# Altium project BGT24LTR11 RF-Shield Board V3.0.PrjPCB (part 2 of 2)

## Sheet 06 Arduino UNO.SchDoc: <Project Name>
size A3; ApprovedBy: <Appr.>; Author: <Author>; CompanyName: Infineon Technologies AG; Engineer: <Rel.>; Organization: Infineon Technologies AG; Address1: IFAG DES S PS; Address2: Am Campeon 1-12  -  85579 Neubiberg  -  Germany; Address3: 85579 Neubiberg; Address4: Germany; Revision: <Rev.>; SheetNumber: 6; Release: RC00; PageSetup: Record=PageOptions|CenterHorizontal=True|CenterVertical=True|PrintScale=1.01|XCorrection=1.00|YCorrection=1.00|PrintKind=0|BorderSize=5000000|LeftOffset=0|BottomOffset=0|Orientation=2|PaperLength=1000|PaperWidth=1000|Scale=100|PaperSource=7|PrintQuality=-4|MediaType=1|DitherType=10|PaperKind=A3|PrintScaleMode=1; Doc_ConfidentialStatus: <Doc_ConfidentialStatus>; Doc_Preliminary: <Doc_Preliminary>
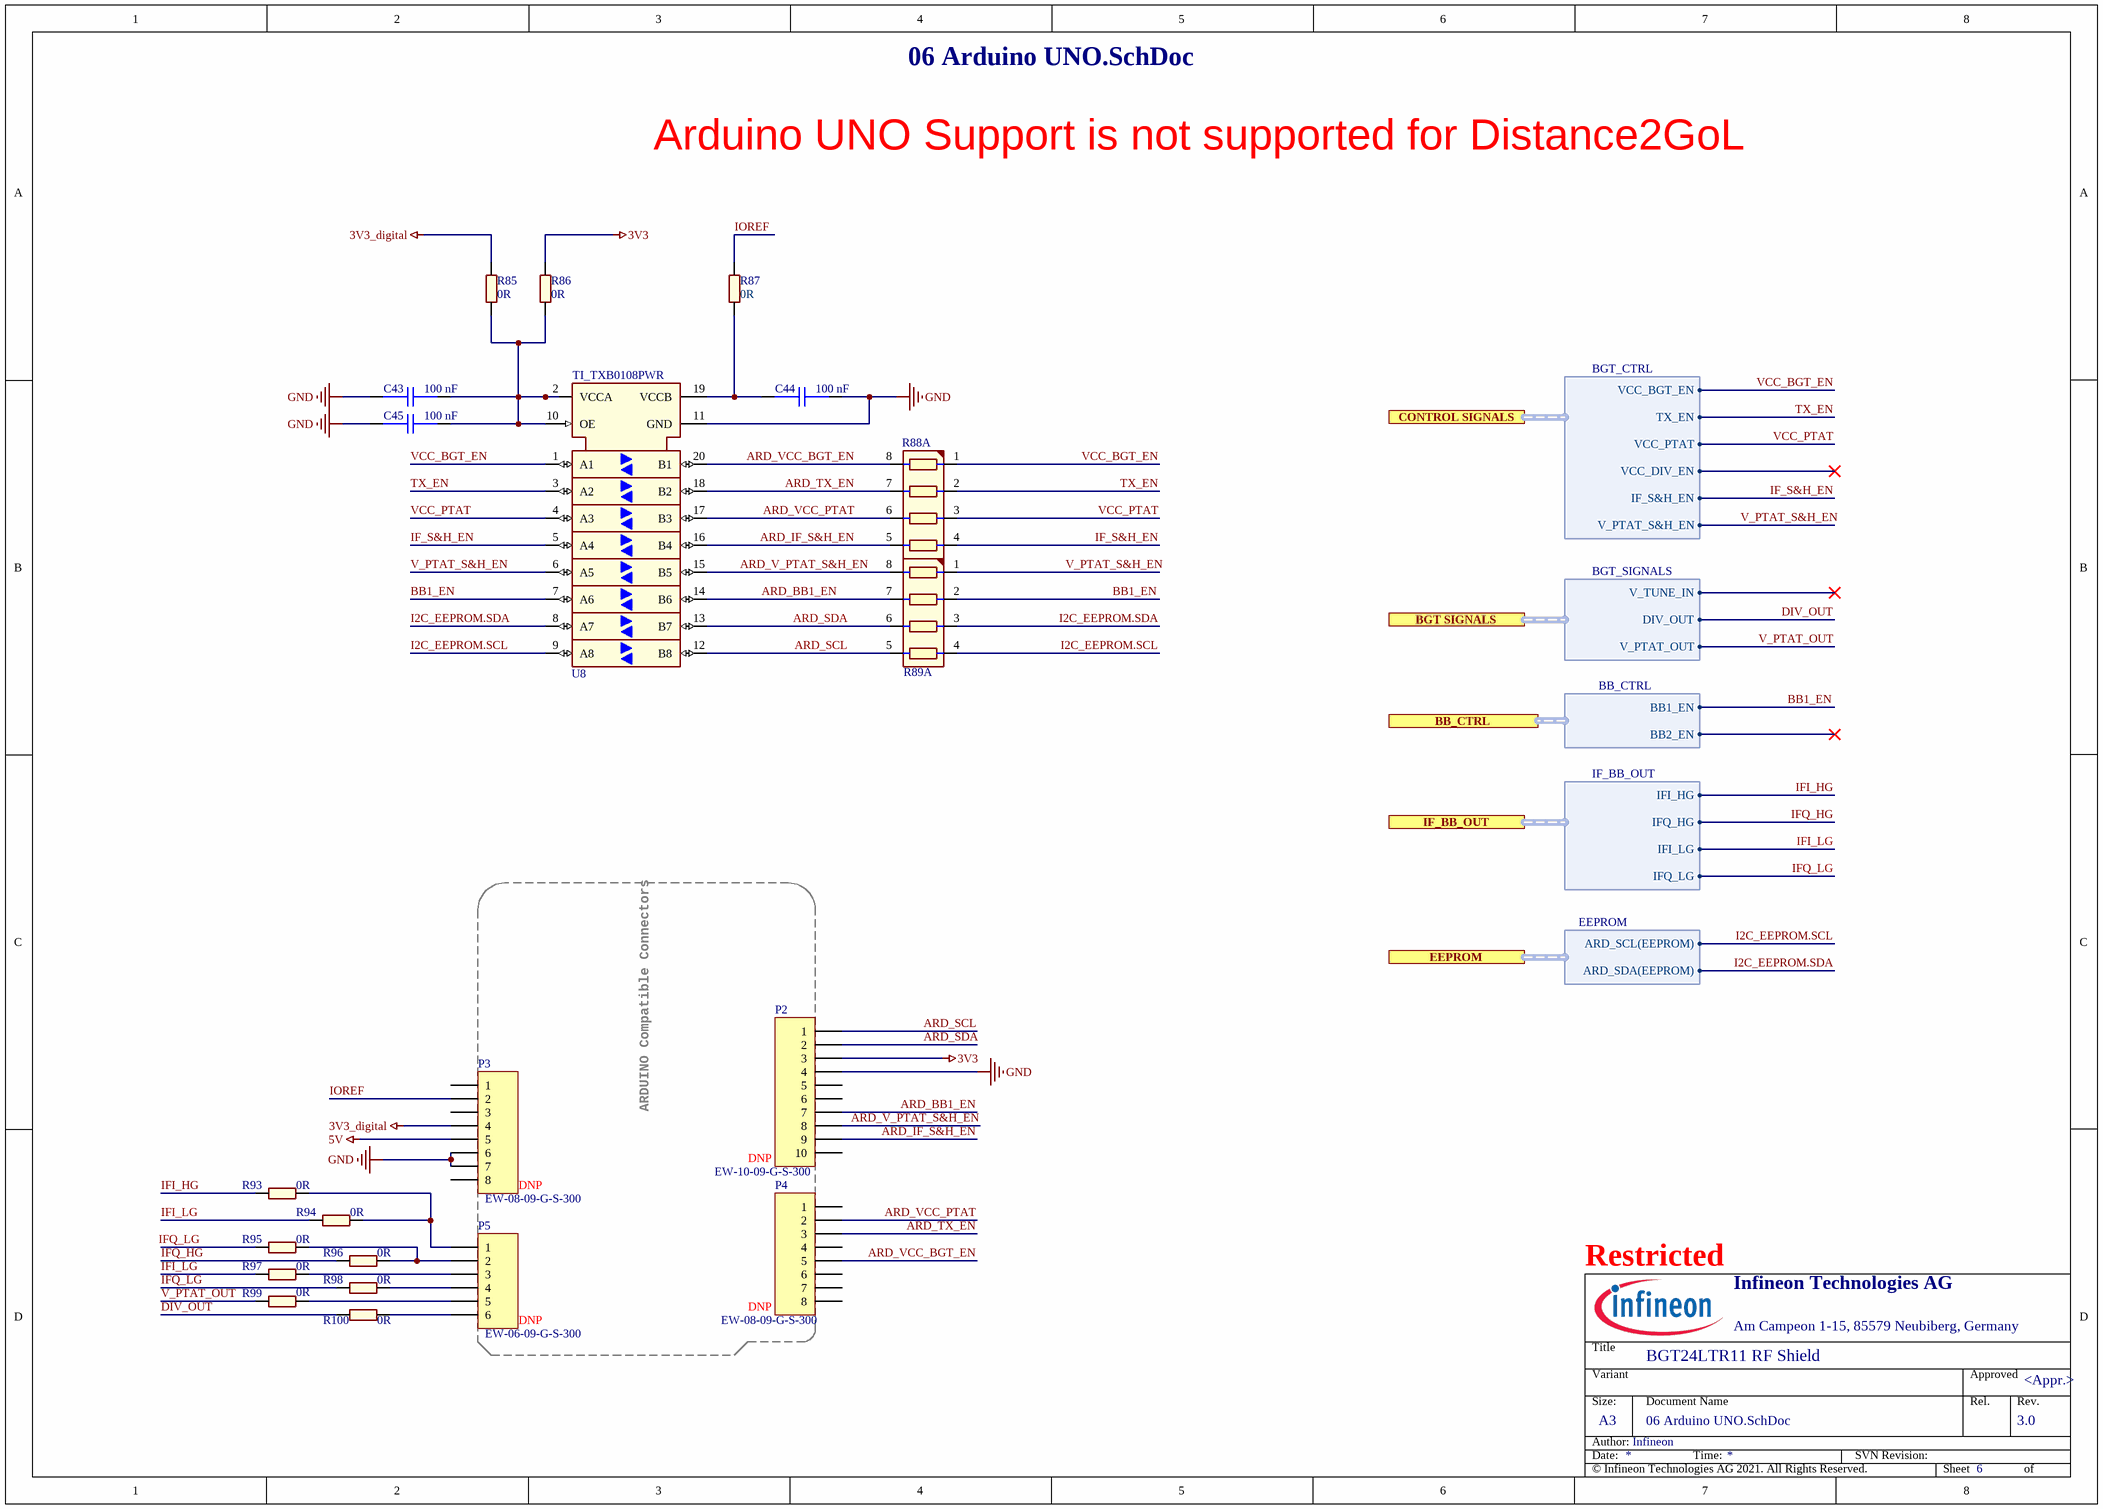
[diagram p4: 06 Arduino UNO.SchDoc]

### Parts
C43  100 nF  [CAPC1005X55N-0_2]
C44  100 nF  [CAPC1005X55N-0_2]
C45  100 nF  [CAPC1005X55N-0_2]
P2  DNP  Manufacturer Part Number: EW-10-09-G-S-300  [HDR1X10_Plug - DNP]
P3  DNP  Manufacturer Part Number: EW-08-09-G-S-300  [HDR1X8_Plug - DNP]
P4  DNP  Manufacturer Part Number: EW-08-09-G-S-300  [HDR1X8_Plug - DNP]
P5  DNP  Manufacturer Part Number: EW-06-09-G-S-300  [HDR1X6_Plug - DNP]
R85  0R  [RESC1005X40N_2]
R86  0R  [RESC1005X40N_2]
R87  0R  [RESC1005X40N_2]
R88  DNP  [RESCAX50P100X200X45-8N - DNP]  (value not drawn)  (part A of 4)
R89  DNP  [RESCAX50P100X200X45-8N - DNP]  (value not drawn)  (part A of 4)
R93  0R  [RESC1005X40N_2]
R94  0R  [RESC1005X40N_2]
R95  0R  [RESC1005X40N_2]
R96  0R  [RESC1005X40N_2]
R97  0R  [RESC1005X40N_2]
R98  0R  [RESC1005X40N_2]
R99  0R  [RESC1005X40N_2]
R100  0R  [RESC1005X40N_2]
U8  DNP  [SOP65P640X120-20N - DNP]  (value not drawn)

### Ports
BB_CTRL (harness BB_CTRL), BGT SIGNALS (harness BGT_SIGNALS), CONTROL SIGNALS (harness BGT_CTRL), EEPROM (harness EEPROM), IF_BB_OUT (harness IF_BB_OUT)

### Harnesses
EEPROM: ARD_SDA(EEPROM), ARD_SCL(EEPROM)
BGT_SIGNALS: V_TUNE_IN, DIV_OUT, V_PTAT_OUT
IF_BB_OUT: IFI_HG, IFQ_HG, IFQ_LG, IFI_LG
BGT_CTRL: VCC_BGT_EN, TX_EN, VCC_PTAT, VCC_DIV_EN, IF_S&H_EN, V_PTAT_S&H_EN
BB_CTRL: BB1_EN, BB2_EN

### Nets
3V3: P2.3 R86.2
3V3_digital: P3.4 R85.2
5V: P3.5
GND: C43.1 C44.2 C45.1 P2.4 P3.6 P3.7 U8.11(GND)
ARD_BB1_EN: P2.7 R89.7 U8.14(B6)
ARD_IF_S&H_EN: P2.9 R88.5 U8.16(B4)
ARD_SCL: P2.1 R89.5 U8.12(B8)
ARD_SDA: P2.2 R89.6 U8.13(B7)
ARD_TX_EN: P4.3 R88.7 U8.18(B2)
ARD_V_PTAT_S&H_EN: P2.8 R89.8 U8.15(B5)
ARD_VCC_BGT_EN: P4.5 R88.8 U8.20(B1)
ARD_VCC_PTAT: P4.2 R88.6 U8.17(B3)
BB1_EN: R89.2 U8.7(A6) ; port BB_CTRL.BB1_EN
DIV_OUT: R100.2 ; port BGT SIGNALS.DIV_OUT  [project net CCU41_In.Slice0]
I2C_EEPROM.SCL: R89.4 U8.9(A8) ; port EEPROM.ARD_SCL(EEPROM)
I2C_EEPROM.SDA: R89.3 U8.8(A7) ; port EEPROM.ARD_SDA(EEPROM)
IF_S&H_EN: R88.4 U8.5(A4) ; port CONTROL SIGNALS.IF_S&H_EN  [project net CCU80_Out.Slice2]
IFI_HG: R93.2 ; port IF_BB_OUT.IFI_HG  [project net IF.I1]
IFI_LG: R94.2 R97.2 ; port IF_BB_OUT.IFI_LG  [project net IF.I2]
IFQ_HG: R96.2 ; port IF_BB_OUT.IFQ_HG  [project net IF.Q1]
IFQ_LG: R95.2 R98.2 ; port IF_BB_OUT.IFQ_LG  [project net IF.Q2]
IOREF: P3.2 R87.2
TX_EN: R88.2 U8.3(A2) ; port CONTROL SIGNALS.TX_EN  [project net CCU80_Out.Slice1]
V_PTAT_OUT: R99.2 ; port BGT SIGNALS.V_PTAT_OUT
V_PTAT_S&H_EN: R89.1 U8.6(A5) ; port CONTROL SIGNALS.V_PTAT_S&H_EN  [project net CCU80_Out.Slice3]
VCC_BGT_EN: R88.1 U8.1(A1) ; port CONTROL SIGNALS.VCC_BGT_EN  [project net CCU80_Out.Slice0]
VCC_PTAT: R88.3 U8.4(A3) ; port CONTROL SIGNALS.VCC_PTAT  [project net CCU40_Out.Slice1]
NetC43_2: C43.2 C45.2 R85.1 R86.1 U8.2(VCCA) U8.10(OE)
NetC44_1: C44.1 R87.1 U8.19(VCCB)
NetP5_1: P5.1 R93.1 R94.1
NetP5_2: P5.2 R95.1 R96.1
NetP5_3: P5.3 R97.1
NetP5_4: P5.4 R98.1
NetP5_5: P5.5 R99.1
NetP5_6: P5.6 R100.1

Not connected (* = marked no-connect by the designer): P2 5 6 10; P3 1 3 8; P4 1 4 6 7 8

### Notes on the sheet
- Arduino UNO Support is not supported for Distance2GoL
- ARDUINO Compatible Connectors
- Title
- Variant
- Approved
- Date:
- Author:
- Size:
- A3
- Document Name
- Time:
- SVN Revision:
- Rel.
- Rev.
- Sheet
- of

### Library data of the parts
C43-C45 = CAP01010597: General Purpose Surface Mount Ceramic Capacitor; Manufacturer: muRata; PartRelease: new; Manufacturer Component Status: Active; ComponentStatus: Released; Voltage: 16Vdc; Tolerance: 2%; TemperaturCharacteristic: C0G; AutomotiveQualified: no; ColibryArticleNumber: 308039; PartNumber: CAP01010597; Value: 100 nF; Type: 100 nF; PackageReference: 0402; PackageDescription: Capacitor,non-polarized,Chip;1.00mm L X 0.50mm W X 0.55mm H; ComponentHeight: 0.55mm; PartType: General Purpose Surface Mount Ceramic Capacitor; ComponentLink1Description: Vendor WebSite; ComponentLink1URL: http://www.murata.com; ComponentLink2Description: Datasheet; ComponentLink2URL: \\MUCSDN31.eu.infineon.com\PCB_Library_Datasheets\GRM1555C1H101GA01.pdf; FixedSupplier: Yes; PartProvision: No; Supplier 1: Farnell; Supplier 2: Digi-Key; Supplier 3: Mouser
P2 = Header 10: Header, 10-Pin, 10mm Height, EW-10-09-G-S-300; Manufacturer: Samtec; LatestRevisionDate: 17-Jul-2002; LatestRevisionNote: Re-released for DXP Platform.; Publisher: Altium Limited
P3 P4 = Header 8: Header, 8-Pin 10mm Height, EW-08-09-G-S-300; Manufacturer: Samtec; LatestRevisionDate: 17-Jul-2002; LatestRevisionNote: Re-released for DXP Platform.; Publisher: Altium Limited
P5 = Header 6: Header, 6-Pin, 10mm Height, EW-06-09-G-S-300; Manufacturer: Samtec; LatestRevisionDate: 17-Jul-2002; LatestRevisionNote: Re-released for DXP Platform.; Publisher: Altium Limited
R85-R87 R93-R100 = RES01800000: 0R/50V/20mOhm; Manufacturer: Vishay; ManufacturerPartNumber: CRCW04020000Z0ED; PartProvision: no; PartRelease: new; Manufacturer Component Status: Active; Symbol Type: Standard Resistor Symbol; Alternate View: yes; ComponentStatus: Released; Power: 1.5A; Voltage: 50V; Tolerance: 20mOhm; AutomotiveQualified: AEC-Q200; ColibryArticleNumber: 339877; PartNumber: RES01800000; PackageReference: 0402; Value: 0R; Type: 0R/50V/20mOhm; PartType: Thick Film Chip Resistor; ComponentHeight: 0.4mm; TK: -; ComponentLink1Description: Vendor WebSite; ComponentLink1URL: http://www.vishay.com/; ComponentLink2Description: Datasheet; ComponentLink2URL: \\MUCSDN31.eu.infineon.com\PCB_Library_Datasheets\dcrcwe3.pdf; FixedSupplier: no
R88 R89 = RES-ARY-STD-08P_00000029: Thick Film Chip Resistor Array; Manufacturer: Panasonic; Manufacturer Order Number: EXB-28V102JX; Manufacturer Component Status: Active; Symbol Type: Resistor; Array; Standard; 8 Pins; Alternate View: Yes; Article Number: 489759; Version Number: V01; Tolerance Neg: 5%; Combined Parameters: TCR:200ppm/K;Tol.:-5%/+5%;Vdc:50V;Idc:-;P:63mW; Automotive Qualified: AEC Q200; Voltage DC (max): 50V; Multible Parts: Yes; Part Type: Resistor; Value: DNP; Tolerance Pos: 5%; Type: Standard; Application: Standard; Style: Array; Technology: Thick Film; Temperature min: -55; Temperature max: 125; Temperature Range: Military; RoHS Compliant: Y; PackageReference: 0402; ComponentLink1Description: Vendor WebSite; ComponentLink1URL: http://panasonic.net/sanyo/index.html; ComponentLink2Description: Datasheet; ComponentLink2URL: http://webnetprod.muc.infineon.com/pcbportal_prod/WorkFlows/AltiumComponent/StandardDocumentation?Versionid=489760; Supplier 1: Farnell; Supplier Part Number 1: 2692859; Supplier 2: DigiKey; Supplier Part Number 2: Y7102TR-ND; Supplier 3: Mouser; Supplier Part Number 3: 667-EXB-28V102JX; PLMStatus: Active; Second Source allowed: Yes; Package Description: Resistor,Chip Array,0.50mm pitch;8 pin,1.00mm W X 2.00mm L X 0.45mm H
U8 = IC02600537: TI_TXB0108PWR; Manufacturer: Texas Instruments; PartRelease: new; Manufacturer Component Status: Active; Symbol Type: 8-Bit Bidirectional Voltage-Level Translator with Auto-Direction Sensing and ±15-kV ESD Protection; ComponentStatus: Released; AutomotiveQualified: no; ColibryArticleNumber: 408700; PartNumber: IC02600537; ComponentName: TI_TXB0108PWR; Type: TXB0108PWR; ComponentHeight: 1.2mm; ManufacturerPartNumber: TXB0108PWR; PackageDescription: SOP,0.65mm pitch;20 pin,4.40mm W X 6.50mm L X 1.20mm H body; PackageReference: TSSOP-20 (PW); ComponentLink1Description: Vendor WebSite; ComponentLink1URL: http://www.ti.com; ComponentLink2Description: Datasheet; ComponentLink2URL: \\MUCSDN31.eu.infineon.com\PCB_Library_Datasheets\TXB0108.pdf; FixedSupplier: yes; PartProvision: no; Supplier 1: Farnell; Supplier Part Number 1: 2437914; Supplier 2: Digi-Key; Supplier Part Number 2: 296-21527-2-ND; Supplier 3: Mouser; Supplier Part Number 3: 595-TXB0108PWR

## Sheet 05 Connectors, LDO, EEPROM.SchDoc: <Project Name>
size A3; ApprovedBy: <Appr.>; Author: <Author>; CompanyName: Infineon Technologies AG; Engineer: <Rel.>; Organization: Infineon Technologies AG; Address1: IFAG DES S PS; Address2: Am Campeon 1-12  -  85579 Neubiberg  -  Germany; Address3: 85579 Neubiberg; Address4: Germany; Revision: <Rev.>; SheetNumber: 5; Release: RC00; PageSetup: Record=PageOptions|CenterHorizontal=True|CenterVertical=True|PrintScale=1.01|XCorrection=1.00|YCorrection=1.00|PrintKind=0|BorderSize=5000000|LeftOffset=0|BottomOffset=0|Orientation=2|PaperLength=1000|PaperWidth=1000|Scale=100|PaperSource=7|PrintQuality=-4|MediaType=1|DitherType=10|PaperKind=A3|PrintScaleMode=1; Doc_ConfidentialStatus: <Doc_ConfidentialStatus>; Doc_Preliminary: <Doc_Preliminary>
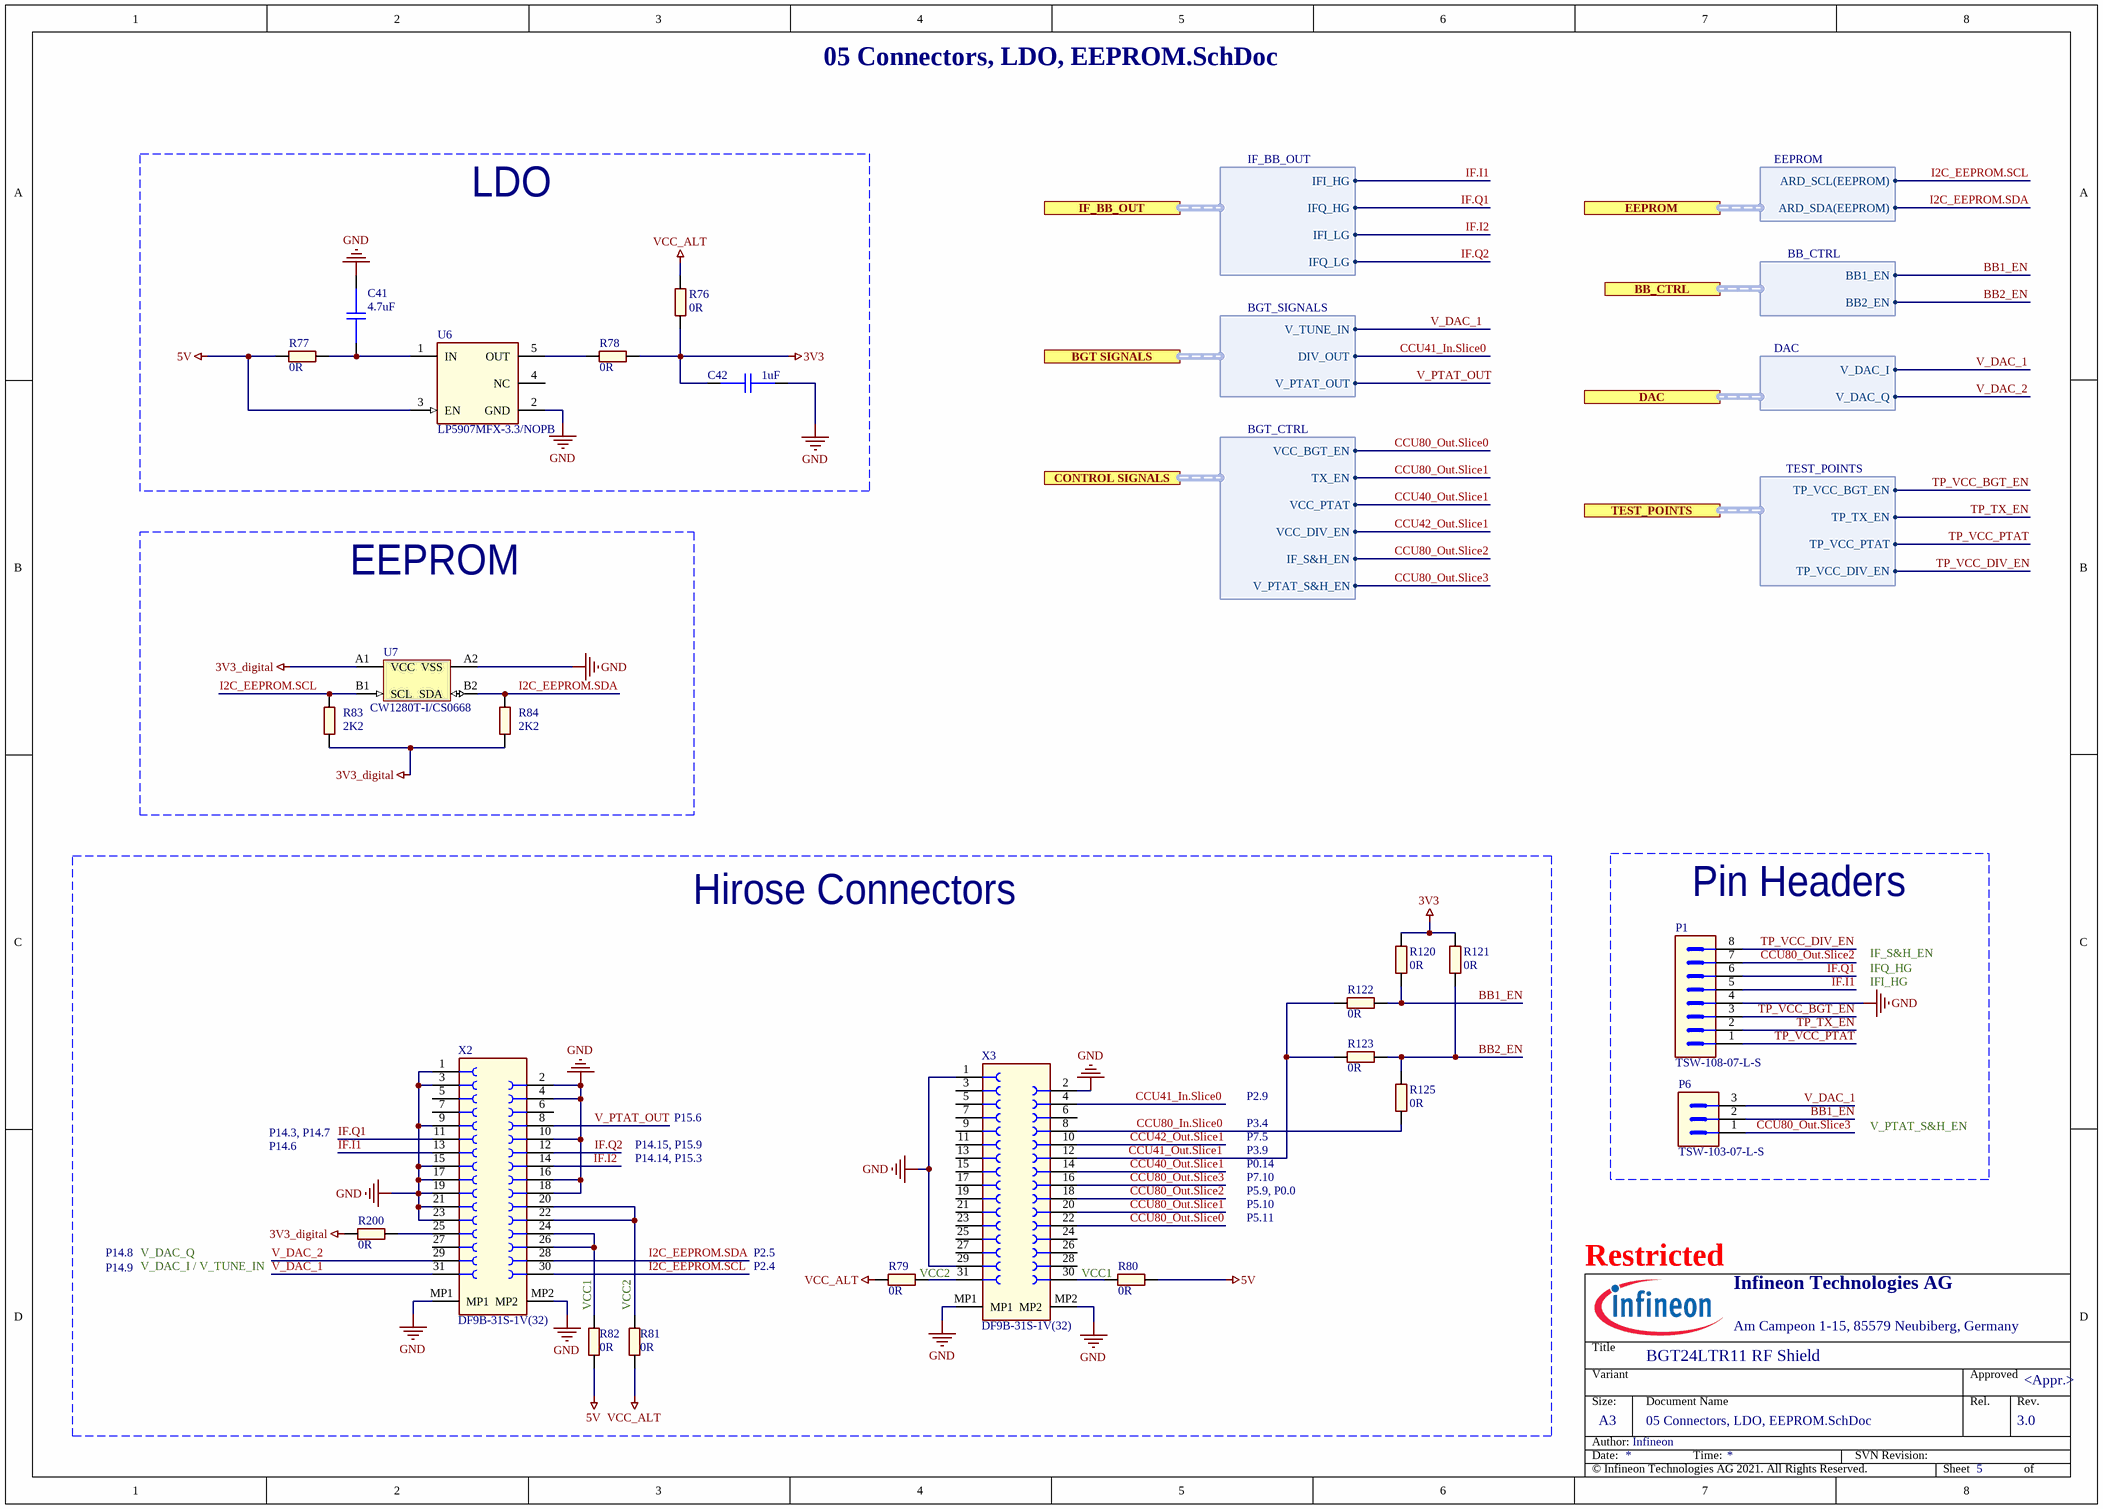
[diagram p5: 05 Connectors, LDO, EEPROM.SchDoc]

### Parts
C41  4.7uF  [CAPC1005X55N-0_2]
C42  1uF  [CAPC1005X55N-0_2]
P1  TSW-108-07-L-S  [CON-M-THT-TSW-108-07-L-S]
P6  TSW-103-07-L-S  [CON-M-THT-TSW-103-07-L-S]
R76  0R  [RESC1005X40N_2]
R77  0R  [RESC1005X40N_2]
R78  0R  [RESC1005X40N_2]
R79  0R  [RESC1005X40N_2]
R80  0R  [RESC1005X40N_2]
R81  0R  [RESC1005X40N_2]
R82  0R  [RESC1005X40N_2]
R83  2K2  [RESC1005X40N_2]
R84  2K2  [RESC1005X40N_2]
R120  0R  [RESC1005X40N_2]
R121  0R  [RESC1005X40N_2]
R122  0R  [RESC1005X40N_2]
R123  0R  [RESC1005X40N_2]
R125  0R  [RESC1005X40N_2]
R200  0R  [RESC1005X40N_2]
U6  LP5907MFX-3.3/NOPB  [SOT95P280X145-5N-2]
U7  CW1280T-I/CS0668  [WLCSP4 (CS0)]
X2  DF9B-31S-1V(32)  [CON-F-SMD-DF9B-31S-1V-32-1]
X3  DF9B-31S-1V(32)  [CON-F-SMD-DF9B-31S-1V-32-1]

### Ports
BB_CTRL (harness BB_CTRL), BGT SIGNALS (harness BGT_SIGNALS), CONTROL SIGNALS (harness BGT_CTRL), DAC (harness DAC), EEPROM (harness EEPROM), IF_BB_OUT (harness IF_BB_OUT), TEST_POINTS (harness TEST_POINTS)

### Harnesses
BGT_CTRL: VCC_BGT_EN, TX_EN, VCC_PTAT, VCC_DIV_EN, IF_S&H_EN, V_PTAT_S&H_EN
EEPROM: ARD_SCL(EEPROM), ARD_SDA(EEPROM)
TEST_POINTS: TP_VCC_BGT_EN, TP_TX_EN, TP_VCC_PTAT, TP_VCC_DIV_EN
DAC: V_DAC_I, V_DAC_Q
BGT_SIGNALS: V_TUNE_IN, DIV_OUT, V_PTAT_OUT
IF_BB_OUT: IFI_HG, IFQ_HG, IFQ_LG, IFI_LG
BB_CTRL: BB1_EN, BB2_EN

### Nets
3V3: C42.2 R76.2 R78.1 R120.1 R121.1
3V3_digital: R83.2 R84.2 R200.2 U7.A1(VCC)
5V: R77.2 R80.1 R82.1 U6.3(EN)
GND: C41.1 C42.1 P1.4 U6.2(GND) U7.A2(VSS) X2.1 X2.2 X2.3 X2.4 X2.9 X2.10 X2.15 X2.16 X2.17 X2.18 X2.19 X2.21 X2.23 X2.MP1 X2.MP2 X3.1 X3.2 X3.29 X3.MP1 X3.MP2
VCC_ALT: R76.1 R79.1 R81.1
BB1_EN: P6.2 R120.2 R122.1 ; port BB_CTRL.BB1_EN
BB2_EN: R121.2 R123.1 R125.1 ; port BB_CTRL.BB2_EN
CCU40_Out.Slice1: X3.14 ; port CONTROL SIGNALS.VCC_PTAT
CCU41_In.Slice0: X3.4 ; port BGT SIGNALS.DIV_OUT
CCU41_Out.Slice1: R122.2 R123.2 X3.12
CCU42_Out.Slice1: X3.10 ; port CONTROL SIGNALS.VCC_DIV_EN
CCU80_In.Slice0: R125.2 X3.8
CCU80_Out.Slice0: X3.22 ; port CONTROL SIGNALS.VCC_BGT_EN
CCU80_Out.Slice1: X3.20 ; port CONTROL SIGNALS.TX_EN
CCU80_Out.Slice2: P1.7 X3.18 ; port CONTROL SIGNALS.IF_S&H_EN
CCU80_Out.Slice3: P6.1 X3.16 ; port CONTROL SIGNALS.V_PTAT_S&H_EN
I2C_EEPROM.SCL: R83.1 U7.B1(SCL) X2.30 ; port EEPROM.ARD_SCL(EEPROM)
I2C_EEPROM.SDA: R84.1 U7.B2(SDA) X2.28 ; port EEPROM.ARD_SDA(EEPROM)
IF.I1: P1.5 X2.13 ; port IF_BB_OUT.IFI_HG
IF.I2: X2.14 ; port IF_BB_OUT.IFI_LG
IF.Q1: P1.6 X2.11 ; port IF_BB_OUT.IFQ_HG
IF.Q2: X2.12 ; port IF_BB_OUT.IFQ_LG
TP_TX_EN: P1.2 ; port TEST_POINTS.TP_TX_EN
TP_VCC_BGT_EN: P1.3 ; port TEST_POINTS.TP_VCC_BGT_EN
TP_VCC_DIV_EN: P1.8 ; port TEST_POINTS.TP_VCC_DIV_EN
TP_VCC_PTAT: P1.1 ; port TEST_POINTS.TP_VCC_PTAT
V_DAC_1: P6.3 X2.31 ; port DAC.V_DAC_I, port BGT SIGNALS.V_TUNE_IN
V_DAC_2: X2.29 ; port DAC.V_DAC_Q
V_PTAT_OUT: X2.8 ; port BGT SIGNALS.V_PTAT_OUT
NetC41_2: C41.2 R77.1 U6.1(IN)
NetR78_2: R78.2 U6.5(OUT)
NetR79_2: R79.2 X3.31
NetR80_2: R80.2 X3.30
NetR81_2: R81.2 X2.20 X2.22
NetR82_2: R82.2 X2.24 X2.26
NetR200_1: R200.1 X2.25

Not connected (* = marked no-connect by the designer): U6 4(NC); X2 5 6 7 27; X3 3 5 6 7 9 11 13 15 17 19 21 23 24 25 26 27 28

### Notes on the sheet
- LDO
- EEPROM
- Hirose Connectors
- (near P1) Pin Headers
- IFQ_HG
- IFI_HG
- IF_S&H_EN
- P15.6
- P2.9
- P3.4
- P14.3, P14.7
- P14.6
- P14.15, P15.9
- P14.14, P15.3
- P7.5
- P0.14
- P5.9, P0.0
- P7.10
- P3.9
- V_PTAT_S&H_EN
- P14.8
- V_DAC_Q
- P2.5
- P5.10
- P5.11
- P14.9
- V_DAC_I / V_TUNE_IN
- (near R82) VCC1
- (near R81) VCC2
- P2.4
- (near R79) VCC2
- (near R80) VCC1
- Title
- Variant
- Approved
- Date:
- Author:
- Size:
- A3
- Document Name
- Time:
- SVN Revision:
- Rel.
- Rev.
- Sheet
- of

### Library data of the parts
C41 C42 = CAP01010597: General Purpose Surface Mount Ceramic Capacitor; Manufacturer: muRata; PartRelease: new; Manufacturer Component Status: Active; ComponentStatus: Released; Voltage: 50Vdc; Tolerance: 2%; TemperaturCharacteristic: C0G; AutomotiveQualified: no; ColibryArticleNumber: 308039; PartNumber: CAP01010597; PackageReference: 0402; PackageDescription: Capacitor,non-polarized,Chip;1.00mm L X 0.50mm W X 0.55mm H; ComponentHeight: 0.55mm; PartType: General Purpose Surface Mount Ceramic Capacitor; ComponentLink1Description: Vendor WebSite; ComponentLink1URL: http://www.murata.com; ComponentLink2Description: Datasheet; ComponentLink2URL: \\MUCSDN31.eu.infineon.com\PCB_Library_Datasheets\GRM1555C1H101GA01.pdf; FixedSupplier: Yes; PartProvision: No; Supplier 1: Farnell; Supplier 2: Digi-Key; Supplier 3: Mouser
  C41: Value: 4.7uF
  C42: Value: 1uF
P1 = 382934: Through hole .025'' SQ Post Header, 2.54mm pitch, 8 pin, vertical, single row; Legacy PartNumber: CON01500577; Manufacturer: Samtec; Manufacturer Component Status: Active; Symbol type: Header 8 Pins; Article Number: 382934; Version Number: V01; Legacy DeviceID: SAM_TSW-108-07-L-S; Combined Parameters: Board-to-Board Header (male);8x1;Mounting:THT;Orient:0° (vertical);Shielded:No; QuickPick: 0° (vertical) / Board-to-Board; Style: Strip; Automotive Qualified: No; ComponentStatus: Released; Second Source allowed: Yes; Voltage DC (max): na; Part Type: Connector; Manufacturer Order Number: TSW-108-07-L-S; Value: TSW-108-07-L-S; Type: Board-to-Board; Temperature min: -55; Temperature max: 125; Temperature Range: Military; ROHS Compliant: Y; ComponentLink1Description: Vendor WebSite; ComponentLink1URL: http://www.samtec.com/; ComponentLink2Description: Datasheet; ComponentLink2URL: http://webnetprod.muc.infineon.com/PCBPortal_Prod/WorkFlows/AltiumComponent/StandardDocumentation?Versionid=382935; Supplier 1: Farnell; Supplier Part Number 1: 2035610; Supplier 2: DigiKey; Supplier Part Number 2: SAM1031-08-ND; Supplier 3: Mouser; PLMStatus: Active; Package Description: Header,vertical,2.54mm pitch;0.64mm lead width,8 pins,1 row,8 pins per row,20.32mm L X 2.54mm W X 8.636mm H body
P6 = 382914: Through hole .025 SQ Post Header, 2.54mm pitch, 3 pin, vertical, single row; Legacy PartNumber: CON01500575; Manufacturer: Samtec; Article Number: 382914; Version Number: V01; Legacy DeviceID: SAM_TSW-103-07-L-S; Combined Parameters: Board-to-Board Header (male);3x1;Mounting:THT;Orient:0Â° (vertical);Shielded:No; QuickPick: 0Â° (vertical) / Board-to-Board; Style: Strip; Automotive Qualified: No; PLMStatus: Active; Second Source allowed: Yes; Voltage DC (max): na; Part Type: Connector; Manufacturer Order Number: TSW-103-07-L-S; Value: TSW-103-07-L-S; Type: Board-to-Board; Temperature min: -55; Temperature max: 125; Temperature Range: Military; ROHS Compliant: Y; ComponentLink1Description: Vendor WebSite; ComponentLink1URL: http://www.samtec.com/; ComponentLink2Description: Datasheet; ComponentLink2URL: http://webnetprod.muc.infineon.com/PCBPortal_Prod/WorkFlows/AltiumComponent/StandardDocumentation?Versionid=382915; Supplier 1: Farnell; Supplier Part Number 1: 2035606; Supplier 2: DigiKey; Supplier Part Number 2: SAM1031-03-ND; Supplier 3: Mouser; Package Description: Header,vertical,2.54mm pitch;0.64mm lead width,3 pins,1 row,3 pins per row,7.62mm L X 2.54mm W X 8.636mm H body
R76 R78-R82 R120-R123 R125 R200 = RES01800000: as R85 on sheet 06 Arduino UNO; PartNumber: RES01800000; PackageReference: 0402; Value: 0R; Type: 0R/50V/20mOhm; PartType: Thick Film Chip Resistor; ComponentHeight: 0.4mm; TK: -; ComponentLink1Description: Vendor WebSite; ComponentLink1URL: http://www.vishay.com/; ComponentLink2Description: Datasheet; ComponentLink2URL: \\MUCSDN31.eu.infineon.com\PCB_Library_Datasheets\dcrcwe3.pdf; FixedSupplier: no
R77 = RES01800000: 0R/50V/20mOhm; Manufacturer: Vishay; PartProvision: no; PartRelease: new; Manufacturer Component Status: Active; Symbol Type: Standard Resistor Symbol; Alternate View: yes; ComponentStatus: Released; Power: 1.5A; Voltage: 50V; Tolerance: 20mOhm; AutomotiveQualified: AEC-Q200; ColibryArticleNumber: 339877; PartNumber: RES01800000; PackageReference: 0402; Value: 0R; Type: 0R/50V/20mOhm; PartType: Thick Film Chip Resistor; ComponentHeight: 0.4mm; TK: -; ComponentLink1Description: Vendor WebSite; ComponentLink1URL: http://www.vishay.com/; ComponentLink2Description: Datasheet; ComponentLink2URL: \\MUCSDN31.eu.infineon.com\PCB_Library_Datasheets\dcrcwe3.pdf; FixedSupplier: no
R83 R84 = RES01800000: 2K2/50V/20mOhm; Manufacturer: Vishay; PartProvision: no; PartRelease: new; Manufacturer Component Status: Active; Symbol Type: Standard Resistor Symbol; Alternate View: yes; ComponentStatus: Released; Power: 1.5A; Voltage: 50V; Tolerance: 20mOhm; AutomotiveQualified: AEC-Q200; ColibryArticleNumber: 339877; PartNumber: RES01800000; PackageReference: 0402; Value: 2K2; Type: 2K2/50V/20mOhm; PartType: Thick Film Chip Resistor; ComponentHeight: 0.4mm; TK: -; ComponentLink1Description: Vendor WebSite; ComponentLink1URL: http://www.vishay.com/; ComponentLink2Description: Datasheet; ComponentLink2URL: \\MUCSDN31.eu.infineon.com\PCB_Library_Datasheets\dcrcwe3.pdf; FixedSupplier: no
U6 = IC02601280: 250mA Ultra-Low-Noise, Low-IQ LDO, 3.3V; Multiple Parts: No; Manufacturer: Texas Instruments; PartRelease: new; Manufacturer Component Status: Active; ComponentStatus: Released; ColibryArticleNumber: 465422; Symbol Type: 250mA Ultra-Low-Noise, Low-IQ LDO; Alternate View: No; PartNumber: IC02601280; ComponentName: LP5907MFX-3.3/NOPB; Type: LP5907; ComponentHeight: 1.45mm; ManufacturerPartNumber: LP5907MFX-3.3/NOPB; PackageDescription: SOT,0.95mm pitch;5 pin,1.60mm W X 2.90mm L X 1.45mm H body; PackageReference: SOT23-5 (DBV); AutomotiveQualified: no; ComponentLink1Description: Vendor WebSite; ComponentLink1URL: http://www.ti.com/; ComponentLink2Description: Datasheet; ComponentLink2URL: \\MUCSDN31.eu.infineon.com\PCB_Library_Datasheets\lp5907mfx.pdf; FixedSupplier: yes; PartProvision: no; Supplier 1: Farnell; Supplier Part Number 1: 2492304; Supplier 2: Digi-Key; Supplier Part Number 2: 296-38557-2-ND; Supplier 3: Mouser; Supplier Part Number 3: 595-LP5907MFX-3.3NPB; Value: LP5907MFX-3.3/NOPB
U7 = 24CW128X: 128K I2C Serial EEPROM with Software Write Protection in CSP4 Package, 0.4mm Pin Pitch
X2 X3 = 525897: SMT Board-to-Board connectors-standard interface connector; Manufacturer: Hirose Connectors; Manufacturer Component Status: Active; Symbol Type: Socket Vertical, 31 Pins with 2 Metal Fittings; Alternate View: No; Article Number: 525897; Version Number: V01; Legacy DeviceID: HRS_DF9B-31S-1V(32); Combined Parameters: Board-to-Board Socket (female);-x-;Mounting:SMT;Orient:0° (vertical);Shielded:No; QuickPick: 0° (vertical) / Board-to-Board; ComponentStatus: Released; Second Source allowed: Yes; Voltage DC (max): na; Multiple Parts: No; Part Type: Connector; Manufacturer Order Number: DF9B-31S-1V(32); Value: DF9B-31S-1V(32); Type: Board-to-Board; Application: Standard Interface; Temperature min: -45; Temperature max: 125; Temperature Range: Automotive; ROHS Compliant: Y; Automotive Qualified: No; PackageReference: SMT; ComponentLink1Description: Vendor WebSite; ComponentLink1URL: http://www.hirose.com/; ComponentLink2Description: Datasheet; ComponentLink2URL: http://webnetprod.muc.infineon.com/PCBPortal_Prod/WorkFlows/AltiumComponent/StandardDocumentation?Versionid=525898; Supplier 1: Farnell; Supplier Part Number 1: 2300358; Supplier 2: DigiKey; Supplier Part Number 2: H10394CT-ND; Supplier 3: Mouser; Supplier Part Number 3: 798-DF9B-31S-1V32; PLMStatus: Active; Package Description: Connector, SMD; 1.00 mm pitch, 31 pin, 19.30 mm L X 4.20 mm W X 3.50 mm H body; System: Connector

## Nets that join several sheets
3V3: 03 BGT24LTR11 (R11.1 R21.2), 04 IF AMP Block (R18.2), 06 Arduino UNO (P2.3 R86.2), 05 Connectors, LDO, EEPROM (5 pins)
3V3_digital: 06 Arduino UNO (P3.4 R85.2), 05 Connectors, LDO, EEPROM (R83.2 R84.2 R200.2 U7.A1)
5V: 06 Arduino UNO (P3.5), 05 Connectors, LDO, EEPROM (R77.2 R80.1 R82.1 U6.3)
GND: 03 BGT24LTR11 (26 pins), 04 IF AMP Block (27 pins), 06 Arduino UNO (7 pins), 05 Connectors, LDO, EEPROM (25 pins)
BB1_EN: 04 IF AMP Block (U5.5 U5.6), 06 Arduino UNO (R89.2 U8.7), 05 Connectors, LDO, EEPROM (P6.2 R120.2 R122.1)
BB2_EN: 04 IF AMP Block (U4.5 U4.6), 05 Connectors, LDO, EEPROM (R121.2 R123.1 R125.1)
CCU40_Out.Slice1: 03 BGT24LTR11 (R14.2), 06 Arduino UNO (R88.3 U8.4), 05 Connectors, LDO, EEPROM (X3.14)
CCU41_In.Slice0: 03 BGT24LTR11 (R8.1), 06 Arduino UNO (R100.2), 05 Connectors, LDO, EEPROM (X3.4)
CCU42_Out.Slice1: 03 BGT24LTR11 (R111.1), 05 Connectors, LDO, EEPROM (X3.10)
CCU80_Out.Slice0: 03 BGT24LTR11 (R4.1), 06 Arduino UNO (R88.1 U8.1), 05 Connectors, LDO, EEPROM (X3.22)
CCU80_Out.Slice1: 03 BGT24LTR11 (R13.1), 06 Arduino UNO (R88.2 U8.3), 05 Connectors, LDO, EEPROM (X3.20)
CCU80_Out.Slice2: 03 BGT24LTR11 (U2.1 U3.1), 06 Arduino UNO (R88.4 U8.5), 05 Connectors, LDO, EEPROM (P1.7 X3.18)
CCU80_Out.Slice3: 03 BGT24LTR11 (U9.1), 06 Arduino UNO (R89.1 U8.6), 05 Connectors, LDO, EEPROM (P6.1 X3.16)
I2C_EEPROM.SCL: 06 Arduino UNO (R89.4 U8.9), 05 Connectors, LDO, EEPROM (R83.1 U7.B1 X2.30)
I2C_EEPROM.SDA: 06 Arduino UNO (R89.3 U8.8), 05 Connectors, LDO, EEPROM (R84.1 U7.B2 X2.28)
IF.I1: 04 IF AMP Block (R47.1), 06 Arduino UNO (R93.2), 05 Connectors, LDO, EEPROM (P1.5 X2.13)
IF.I2: 04 IF AMP Block (C15.1 R30.2 R31.2 TP2.1), 06 Arduino UNO (R94.2 R97.2), 05 Connectors, LDO, EEPROM (X2.14)
IF.Q1: 04 IF AMP Block (R53.1), 06 Arduino UNO (R96.2), 05 Connectors, LDO, EEPROM (P1.6 X2.11)
IF.Q2: 04 IF AMP Block (C38.2 R70.2 R71.2 TP4.1), 06 Arduino UNO (R95.2 R98.2), 05 Connectors, LDO, EEPROM (X2.12)
NetC20_2: 03 BGT24LTR11 (R25.1 U2.4), 04 IF AMP Block (C20.2 C26.2 R35.2 R43.2)
NetC28_2: 03 BGT24LTR11 (R28.1 U3.4), 04 IF AMP Block (C28.2 C31.2 R57.2 R68.1)
TP_TX_EN: 03 BGT24LTR11 (C7.1 R13.2 U1.5), 05 Connectors, LDO, EEPROM (P1.2)
TP_VCC_BGT_EN: 03 BGT24LTR11 (5 pins), 05 Connectors, LDO, EEPROM (P1.3)
TP_VCC_DIV_EN: 03 BGT24LTR11 (Q2.3 R7.1 R111.2), 05 Connectors, LDO, EEPROM (P1.8)
TP_VCC_PTAT: 03 BGT24LTR11 (R12.2 R14.1 U1.16), 05 Connectors, LDO, EEPROM (P1.1)
V_DAC_1: 03 BGT24LTR11 (R16.2), 04 IF AMP Block (R102.2), 05 Connectors, LDO, EEPROM (P6.3 X2.31)
V_DAC_2: 04 IF AMP Block (R104.2), 05 Connectors, LDO, EEPROM (X2.29)
V_PTAT_OUT: 03 BGT24LTR11 (R15.1), 06 Arduino UNO (R99.2), 05 Connectors, LDO, EEPROM (X2.8)

## Assembly variants
Distance2GoL: not fitted C3 C4 C7 C11 C12 C14 C22 C27 C29 C36 C43 C44 C45 C46 C49 C50 P1 P2 P3 P4 P5 P6 R1 R3 R6 R12 R29 R31 R34 R35 R38 R39 R40 R43 R57 R62 R64 R67 R68 R69 R71 R72 R76 R85 R86 R87 R88 R89 R93 R94 R95 R96 R97 R98 R99 R100 R102 R103 R104 R107 R108 R109 R110 R112 R113 R118 R120 R121 R123 U2 U3 U8 U9